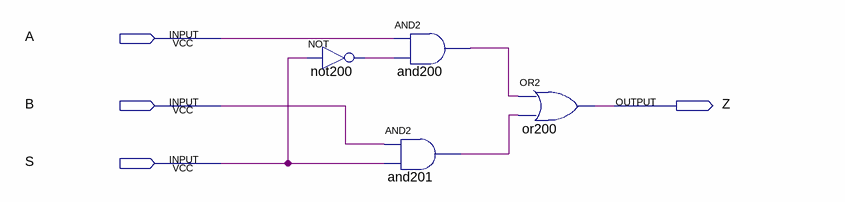
[diagram p0: schematic sheet]
// Quartus schematic Mux21_1bit.bdf as structural Verilog: 4 symbols, 4 pins
module Mux21_1bit (
  input  A,
  input  B,
  input  S,
  output Z
);

  wire and200_out, and201_out, not200_out;

  not not200 (not200_out, S);
  and and200 (and200_out, A, not200_out);
  and and201 (and201_out, B, S);
  or or200 (Z, and200_out, and201_out);
endmodule
